# Altium schematic sheet Connectors.SchDoc
size A4; SheetNumber: 8; SheetTotal: 8
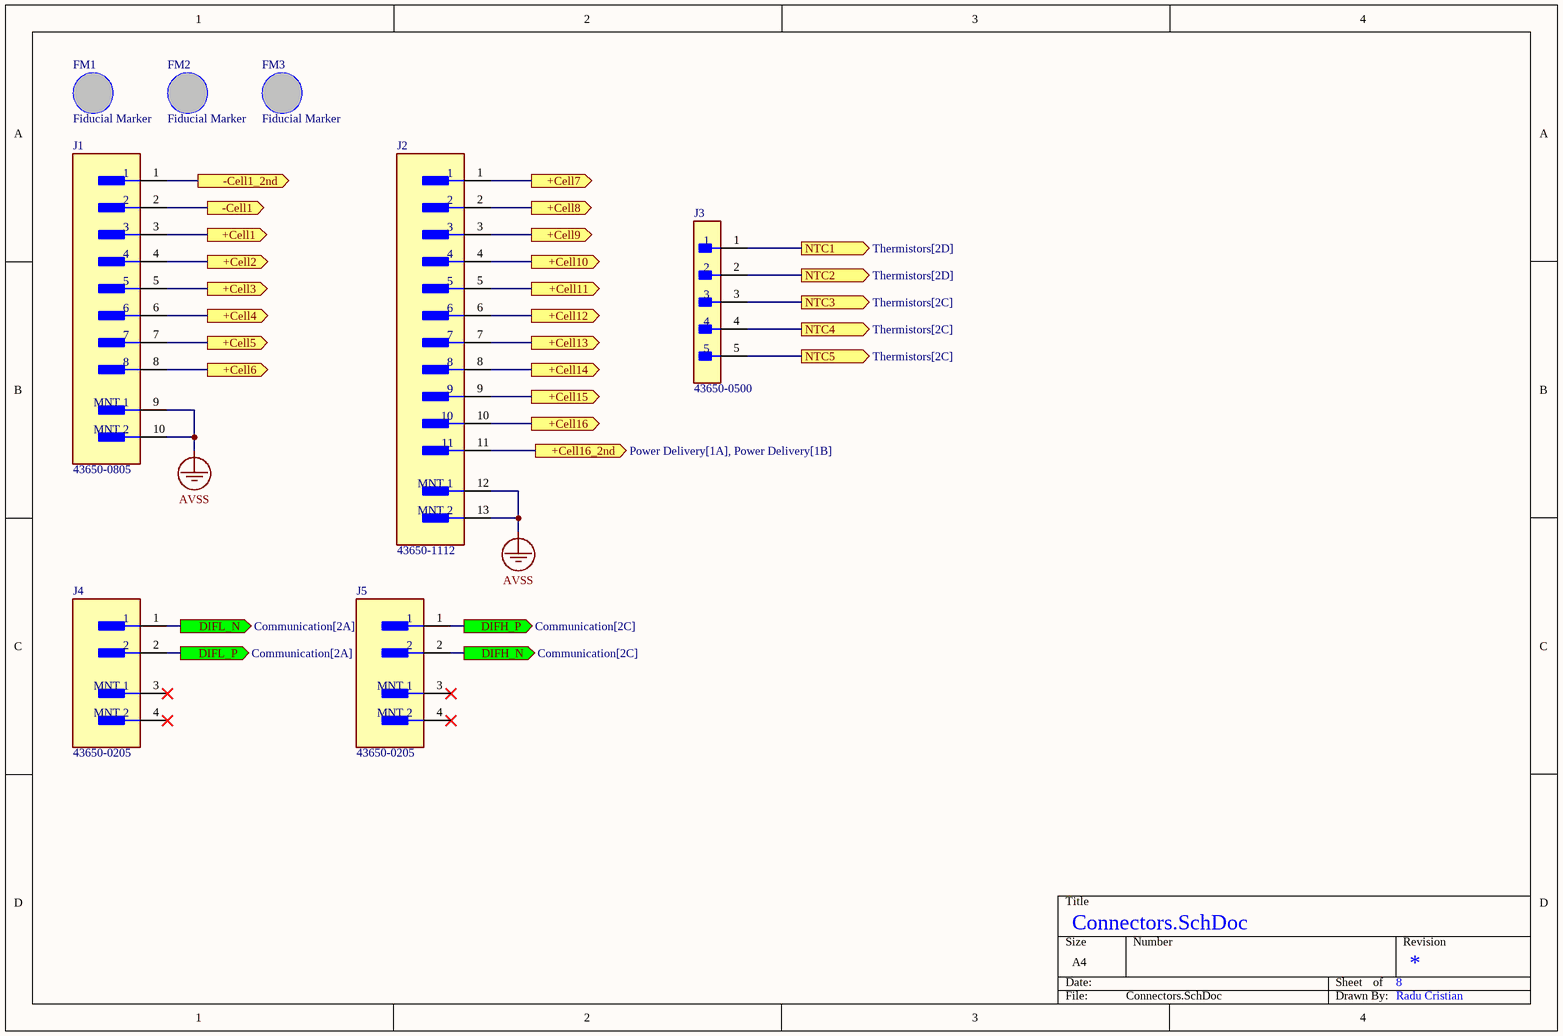
[diagram p0: Connectors.SchDoc]

## Parts
FM1  Fiducial Marker  [Fiducial Marker-Footprint-1]
FM2  Fiducial Marker  [Fiducial Marker-Footprint-1]
FM3  Fiducial Marker  [Fiducial Marker-Footprint-1]
J1  43650-0805  [FP-436500805-MFG]
J2  43650-1112  [FP-43650-1112-MFG]
J3  43650-0500  [FP-43650-0500-MFG]
J4  43650-0205  [FP-43650-0205-MFG]
J5  43650-0205  [FP-43650-0205-MFG]

## Ports
+Cell1 (out, see Cell Balancing[1D], Cell Voltage Sensing[1D]), +Cell2 (out, see Cell Balancing[1D], Cell Voltage Sensing[1D]), +Cell3 (out, see Cell Balancing[1C], Cell Voltage Sensing[1D]), +Cell4 (out, see Cell Balancing[1C], Cell Voltage Sensing[1C]), +Cell5 (out, see Cell Balancing[1C], Cell Voltage Sensing[1C]), +Cell6 (out, see Cell Balancing[1C], Cell Voltage Sensing[1C]), +Cell7 (out, see Cell Balancing[1C], Cell Voltage Sensing[1C]), +Cell8 (out, see Cell Balancing[1C], Cell Voltage Sensing[1C]), +Cell9 (out, see Cell Balancing[1B], Cell Voltage Sensing[1C]), +Cell10 (out, see Cell Balancing[1B], Cell Voltage Sensing[1B]), +Cell11 (out, see Cell Balancing[1B], Cell Voltage Sensing[1B]), +Cell12 (out, see Cell Balancing[1B], Cell Voltage Sensing[1B]), +Cell13 (out, see Cell Balancing[1B], Cell Voltage Sensing[1B]), +Cell14 (out, see Cell Balancing[1B], Cell Voltage Sensing[1B]), +Cell15 (out, see Cell Balancing[1B], Cell Voltage Sensing[1B]), +Cell16 (out, see Cell Balancing[1A], Cell Voltage Sensing[1B]), +Cell16_2nd (out, see Power Delivery[1A], Power Delivery[1B]), -Cell1 (out, see Cell Balancing[1D], Cell Voltage Sensing[1D]), -Cell1_2nd (out, see Power Delivery[2A]), DIFH_N (out, see Communication[2C]), DIFH_P (out, see Communication[2C]), DIFL_N (out, see Communication[2A]), DIFL_P (out, see Communication[2A]), NTC1 (out, see Thermistors[2D]), NTC2 (out, see Thermistors[2D]), NTC3 (out, see Thermistors[2C]), NTC4 (out, see Thermistors[2C]), NTC5 (out, see Thermistors[2C])

## Nets
AVSS: J1.9(MNT_1) J1.10(MNT_2) J2.12(MNT_1) J2.13(MNT_2)
+Cell1: J1.3 ; port +Cell1
+Cell2: J1.4 ; port +Cell2
+Cell3: J1.5 ; port +Cell3
+Cell4: J1.6 ; port +Cell4
+Cell5: J1.7 ; port +Cell5
+Cell6: J1.8 ; port +Cell6
+Cell7: J2.1 ; port +Cell7
+Cell8: J2.2 ; port +Cell8
+Cell9: J2.3 ; port +Cell9
+Cell10: J2.4 ; port +Cell10
+Cell11: J2.5 ; port +Cell11
+Cell12: J2.6 ; port +Cell12
+Cell13: J2.7 ; port +Cell13
+Cell14: J2.8 ; port +Cell14
+Cell15: J2.9 ; port +Cell15
+Cell16: J2.10 ; port +Cell16
+Cell16_2nd: J2.11 ; port +Cell16_2nd
-Cell1: J1.2 ; port -Cell1
-Cell1_2nd: J1.1 ; port -Cell1_2nd
DIFH_N: J5.2 ; port DIFH_N
DIFH_P: J5.1 ; port DIFH_P
DIFL_N: J4.1 ; port DIFL_N
DIFL_P: J4.2 ; port DIFL_P
NTC1: J3.1 ; port NTC1
NTC2: J3.2 ; port NTC2
NTC3: J3.3 ; port NTC3
NTC4: J3.4 ; port NTC4
NTC5: J3.5 ; port NTC5

Not connected (* = marked no-connect by the designer): J4 3(MNT_1)* 4(MNT_2)*; J5 3(MNT_1)* 4(MNT_2)*

## Notes on the sheet
- Radu Cristian

## Library data of the parts
FM1-FM3 = CMP-00003-4: fancy style
J1 = CMP-002-00071-1: Header Connector, pcb Mount, recept, 8 Contacts, pin, 0.118 Pitch, pc Tail Terminal; Connector Type: Male Pin; Voltage Rating: 600V; Pins: 8; Max Operating Temperature: 105°C; Mounting Technology: Through Hole; Min Operating Temperature: -40°C
J2 = CMP-00257-00277522-1: 43650-1112 Conn Power HDR 11 POS 3mm Solder RA SMD 11 Terminal 1 Port Micro-Fit 3.0™ Embossed T/R; NexarPartId: 277522; Manufacturer Lifecycle Status: ACTIVE; Plating: Tin; Number of Circuits: 11; Connector Type: Male Pin; Gender: Male; Voltage Rating (DC): 250V; Voltage Rating: 600V; Glow Wire Compliant: Compliant; Current Rating: 5A; Orientation: Right Angle; Country of Origin: US; Lead Pitch: 3mm; Flammability Rating: UL94 V-0; Contact Material: Brass; Max Operating Temperature: 105°C; Min Operating Temperature: -40°C; Number of Contacts: 11; Number of Positions: 11; Pitch: 3mm; Housing Material: Polymer; Lifecycle Status: Production; Fastening Type: Ramp; Termination: Solder; RoHS: Compliant; Contact Gender: Male; Halogen Free: Low Halogen; Color: Black; Contact Plating: Tin; Number of Rows: 1; Lead Free: Contains Lead; Mount: Surface Mount; Housing Color: Black
J3 = CMP-04776-000912-1: CONN HEADER R/A 5POS 3MM; Manufacturer Series: 43650; Contact Resistance: 10mR; MIL Conformance: No; Number of Terminals/Pins: 5; Number of Rows Loaded: 1; Gender: Male; Current Rating: 5A; Option: General Purpose; Voltage Rating: 600V; Voltage Rating (DC): 250V; Glow Wire Compliant: Compliant; Additional Feature: POLARIZED; Contact Gender: Male; Mount: Through Hole; Series: 43650; Housing Material: Thermoplastic; Contact Material: Brass; Mixed Contacts: No; Max Operating Temperature: 105°C; Orientation: Right Angle; Package Quantity: 2023; Number of Rows: 1; Color: Black; Flammability Rating: UL94 V-0; Length: 18.65mm; Lead Free: Contains Lead; Housing Color: Black; Number of Circuits: 5; Number of Ports: 1; Mounting Style: RIGHT ANGLE; Radiation Hardening: No; IEC Conformance: No; Depth: 9.9mm; Min Operating Temperature: -40°C; Number of Contacts: 5; DIN Conformance: No; Filter Feature: No; Packaging: Tray; Contact Plating: Tin; RoHS Compliant: Yes; Number of Positions: 5; Halogen Free: Low Halogen; Termination: Solder; Pitch: 3mm
J4 J5 = CMP-00257-07672643-1: 43650-0205 Conn Wire to Board HDR 2 POS 3mm Solder RA Side Entry Thru-Hole Micro-Fit 3.0™ Tray; Manufacturer Lifecycle Status: ACTIVE; Plating: Tin; Glow Wire Compliant: Compliant; Number of Contacts: 2; Gender: Male; Voltage Rating: 600V; Current Rating: 5A; Lifecycle Status: Production; RoHS: Compliant; Number of Rows: 1; Housing Material: Thermoplastic; Country of Origin: US; Number of Circuits: 2; Halogen Free: Low Halogen; Orientation: Right Angle; Termination: Through Hole; Pitch: 3mm; Contact Material: Brass; Contact Plating: Gold; NexarPartId: 7672643; Number of Positions: 2